# EAGLE design final (EAGLE 9.4.1)
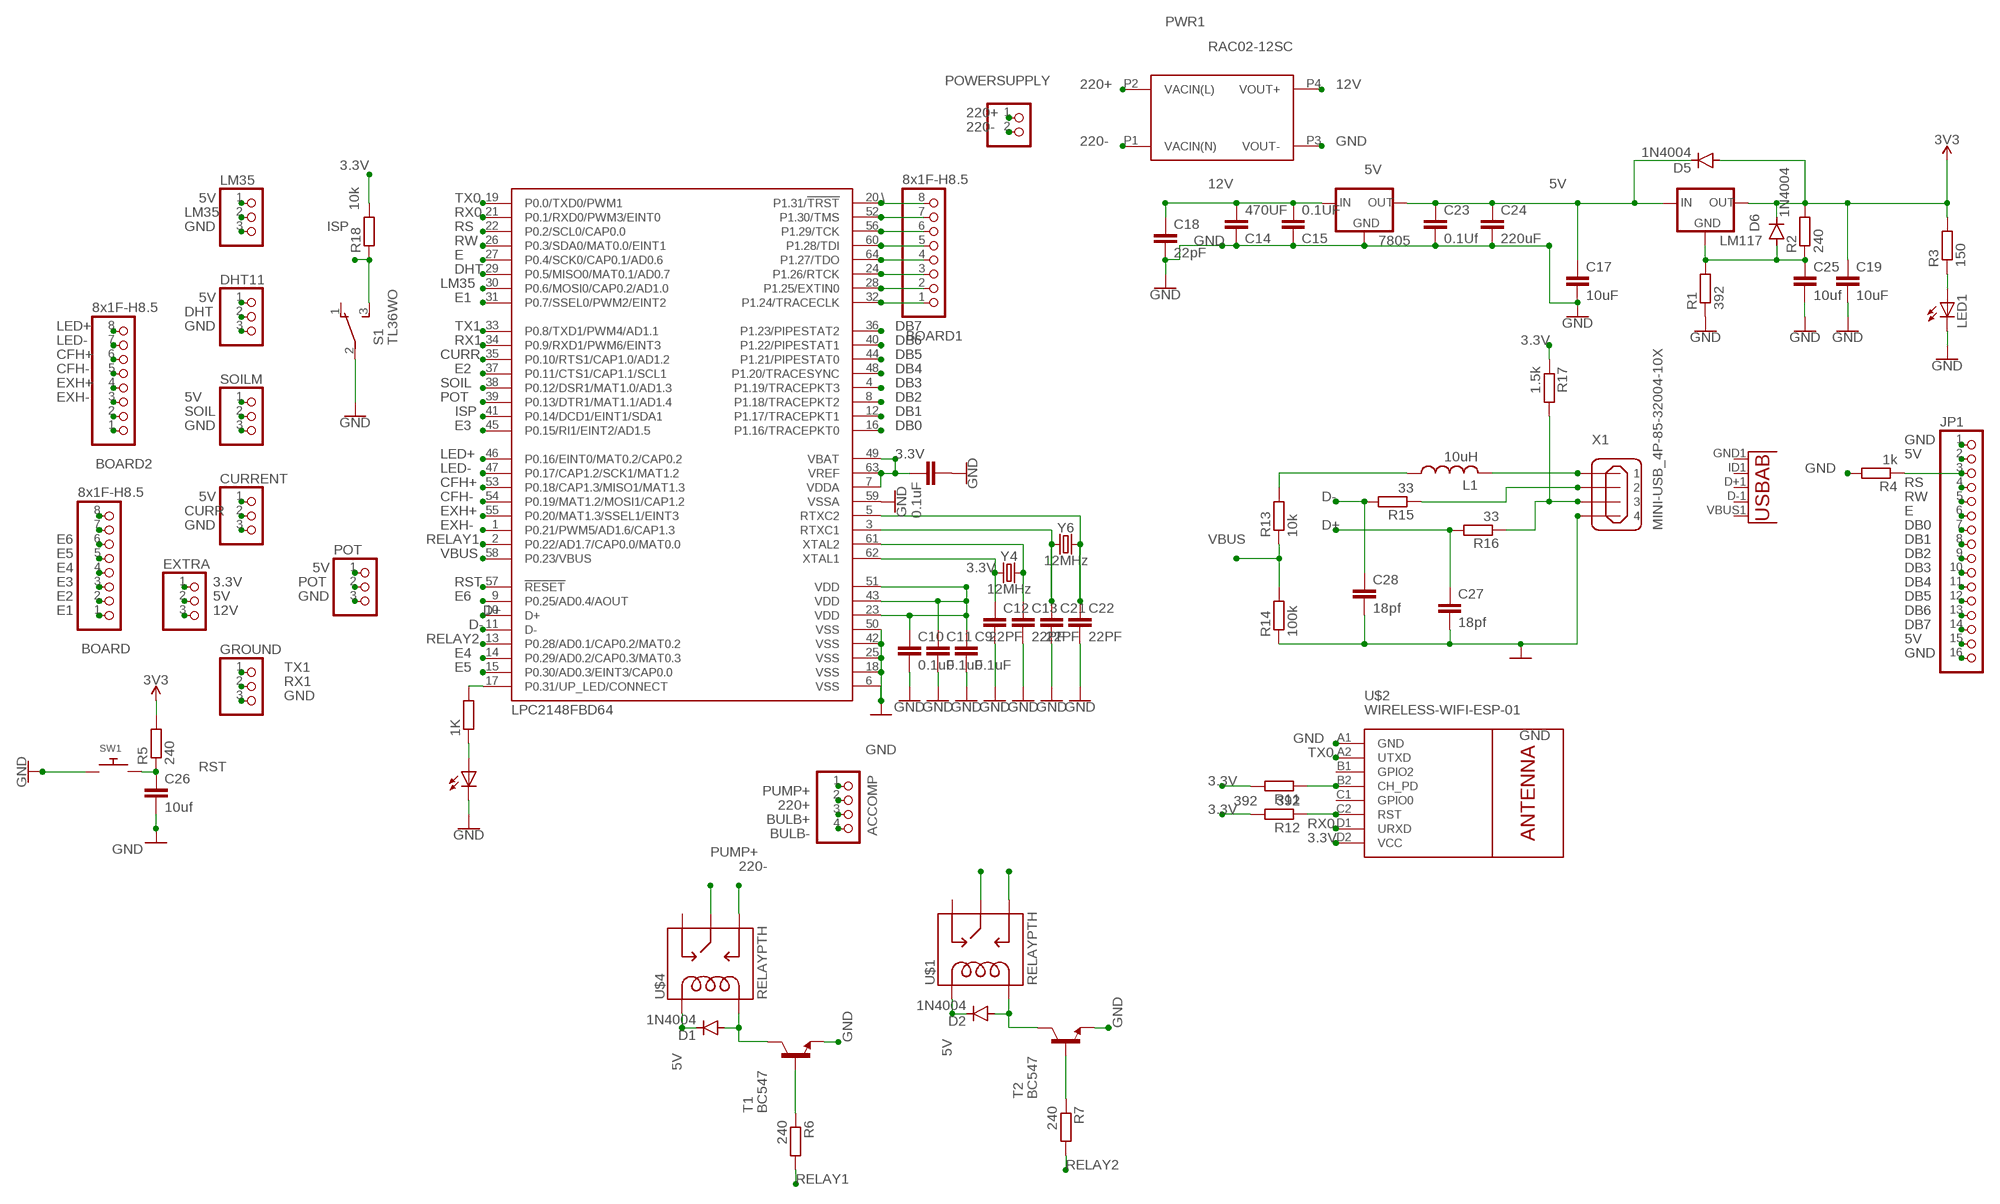
[diagram p0: schematic, sheet 1]

## Parts
1K  1k  R-EU_0204/5  [0204/5]
7805  5V  78XXL  [78XXL]
ACCOMP  PINHD-1X4  [1X04]
BOARD  8x1F-H8.5  PINHD-1X8  [1X08]
BOARD1  8x1F-H8.5  PINHD-1X8  [1X08]
BOARD2  8x1F-H8.5  PINHD-1X8  [1X08]
C9  0.1uF  22PF-0603-50V-5%  [0603]
C10  0.1uF  22PF-0603-50V-5%  [0603]
C11  0.1uF  22PF-0603-50V-5%  [0603]
C12  22PF  22PF-0603-50V-5%  [0603]
C13  22PF  22PF-0603-50V-5%  [0603]
C14  470UF  22PF-0603-50V-5%  [0603]
C15  0.1UF  22PF-0603-50V-5%  [0603]
C16  0.1uF  22PF-0603-50V-5%  [0603]
C17  10uF  22PF-0603-50V-5%  [0603]
C18  22pF  22PF-0603-50V-5%  [0603]
C19  10uF  22PF-0603-50V-5%  [0603]
C21  22PF  22PF-0603-50V-5%  [0603]
C22  22PF  22PF-0603-50V-5%  [0603]
C23  0.1Uf  22PF-0603-50V-5%  [0603]
C24  220uF  22PF-0603-50V-5%  [0603]
C25  10uf  22PF-0603-50V-5%  [0603]
C26  10uf  22PF-0603-50V-5%  [0603]
C27  18pf  22PF-0603-50V-5%  [0603]
C28  18pf  22PF-0603-50V-5%  [0603]
CURRENT  PINHD-1X3  [1X03]
D1  1N4004  [DO41-10]
D2  1N4004  [DO41-10]
D5  1N4004  [DO41-10]
D6  1N4004  [DO41-10]
DHT11  PINHD-1X3  [1X03]
EXTRA  PINHD-1X3  [1X03]
GROUND  PINHD-1X3  [1X03]
JP1  PINHD-1X16  [1X16]
L1  10uH  L-US0204/5  [0204/5]
LED1  LED5MM  [LED5MM]
LED2  LED5MM  [LED5MM]
LM35  PINHD-1X3  [1X03]
LM117  78XXL  [78XXL]
POT  PINHD-1X3  [1X03]
POWERSUPPLY  PINHD-1X2  [1X02]
PWR1  RAC02-12SC  [LOW_PROFILE_POWER_MODULE]
R1  392  R-EU_0204/5  [0204/5]
R2  240  R-EU_0204/5  [0204/5]
R3  150  R-EU_0204/5  [0204/5]
R4  1k  R-EU_0204/5  [0204/5]
R5  240  R-EU_0204/5  [0204/5]
R6  240  R-EU_0204/5  [0204/5]
R7  240  R-EU_0204/5  [0204/5]
R11  392  R-EU_0204/5  [0204/5]
R12  392  R-EU_0204/5  [0204/5]
R13  10k  R-EU_0204/5  [0204/5]
R14  100k  R-EU_0204/5  [0204/5]
R15  33  R-EU_0204/5  [0204/5]
R16  33  R-EU_0204/5  [0204/5]
R17  1.5k  R-EU_0204/5  [0204/5]
R18  10k  R-EU_0204/5  [0204/5]
S1  TL36WO  [TL3XWO]
SOILM  PINHD-1X3  [1X03]
SW1  SWITCH_PUSHBUTTONC&K_KSS  [BTN_CK_KSS]
T1  BC547  [TO92]
T2  BC547  [TO92]
U1  LPC2148FBD64  [TSQFP50P1200X1200X160-64N]
U2  USB""  [USB-MICRO-SMD]
U$1  RELAYPTH  [SRD-05VDC-SL-C]
U$2  WIRELESS-WIFI-ESP-01  [WIRELESS-WIFI-ESP-01]
U$4  RELAYPTH  [SRD-05VDC-SL-C]
X1  MINI-USB_4P-85-32004-10X  [85-32004-10X]
Y4  12MHz  CRYSTAL-16MHZPTH-HC49US  [HC49US]
Y6  12MHz  CRYSTAL-16MHZPTH-HC49US  [HC49US]

## Nets
3.3V: C9.1 C10.1 C11.1 C16.2 EXTRA.1 R11.2 R12.2 R17.1 R18.2 U1.7(VDDA) U1.23(VDD) U1.43(VDD) U1.49(VBAT) U1.51(VDD) U1.63(VREF) U$2.D2(VCC)
5V: 7805.OUT C17.1 C19.1 C23.1 C24.1 CURRENT.1 D1.C D2.C D5.A D5.C D6.C DHT11.1 EXTRA.2 JP1.2 JP1.15 LM35.1 LM117.IN LM117.OUT POT.1 R2.2 R3.2 R5.2 SOILM.1 U$1.COIL1 U$4.COIL1 ; supply symbol labelled 3V3
12V: 7805.IN C14.1 C15.1 C18.1 EXTRA.3 PWR1.P4(VOUT+)
220+: ACCOMP.2 POWERSUPPLY.1 PWR1.P2(VACIN(L))
220-: POWERSUPPLY.2 PWR1.P1(VACIN(N)) U$4.SWOPEN
\: BOARD1.8 U1.20(P1.31/!TRST)
BULB+: ACCOMP.3 U$1.SWCOMMON
BULB-: ACCOMP.4
CFH+: BOARD2.6 U1.53(P0.18/CAP1.3/MISO1/MAT1.3)
CFH-: BOARD2.5 U1.54(P0.19/MAT1.2/MOSI1/CAP1.2)
CURR: CURRENT.2 U1.35(P0.10/RTS1/CAP1.0/AD1.2)
D+: C27.1 R16.2 U1.10(D+)
D-: C28.1 R15.2 U1.11(D-)
DB0: JP1.7 U1.16(P1.16/TRACEPKT0)
DB1: JP1.8 U1.12(P1.17/TRACEPKT1)
DB2: JP1.9 U1.8(P1.18/TRACEPKT2)
DB3: JP1.10 U1.4(P1.19/TRACEPKT3)
DB4: JP1.11 U1.48(P1.20/TRACESYNC)
DB5: JP1.12 U1.44(P1.21/PIPESTAT0)
DB6: JP1.13 U1.40(P1.22/PIPESTAT1)
DB7: JP1.14 U1.36(P1.23/PIPESTAT2)
DHT: DHT11.2 U1.29(P0.5/MISO0/MAT0.1/AD0.7)
E: JP1.6 U1.27(P0.4/SCK0/CAP0.1/AD0.6)
E1: BOARD.1 U1.31(P0.7/SSEL0/PWM2/EINT2)
E2: BOARD.2 U1.37(P0.11/CTS1/CAP1.1/SCL1)
E3: BOARD.3 U1.45(P0.15/RI1/EINT2/AD1.5)
E4: BOARD.4 U1.14(P0.29/AD0.2/CAP0.3/MAT0.3)
E5: BOARD.5 U1.15(P0.30/AD0.3/EINT3/CAP0.0)
E6: BOARD.6 U1.9(P0.25/AD0.4/AOUT)
EXH+: BOARD2.4 U1.55(P0.20/MAT1.3/SSEL1/EINT3)
EXH-: BOARD2.3 U1.1(P0.21/PWM5/AD1.6/CAP1.3)
GND: 7805.GND C9.2 C10.2 C11.2 C12.2 C13.2 C14.2 C15.2 C16.1 C17.2 C18.2 C19.2 C21.2 C22.2 C23.2 C24.2 C25.2 C26.2 C27.2 C28.2 CURRENT.3 DHT11.3 GROUND.3 JP1.1 JP1.16 LED1.K(C) LED2.K(C) LM35.3 POT.3 PWR1.P3(VOUT-) R1.1 R4.2 R14.1 S1.2(P) SOILM.3 SW1.P$1 T1.1(E) T2.1(E) U1.6(VSS) U1.18(VSS) U1.25(VSS) U1.42(VSS) U1.50(VSS) U1.59(VSSA) U$2.A1(GND) X1.4
ISP: R18.1 S1.3(S) U1.41(P0.14/DCD1/EINT1/SDA1)
LED+: BOARD2.8 U1.46(P0.16/EINT0/MAT0.2/CAP0.2)
LED-: BOARD2.7 U1.47(P0.17/CAP1.2/SCK1/MAT1.2)
LM35: LM35.2 U1.30(P0.6/MOSI0/CAP0.2/AD1.0)
N$1: R6.1 T1.2(B)
N$2: R7.1 T2.2(B)
N$3: D1.A T1.3(C) U$4.COIL0
N$4: D2.A T2.3(C) U$1.COIL0
N$6: C12.1 U1.62(XTAL1) Y4.1
N$10: BOARD.8
N$11: BOARD.7
N$12: C13.1 U1.61(XTAL2) Y4.2
N$14: U$1.SWOPEN
N$19: BOARD1.7 U1.52(P1.30/TMS)
N$23: JP1.3 R4.1
N$28: C21.1 U1.3(RTXC1) Y6.1
N$37: C25.1 D6.A LM117.GND R1.2 R2.1
N$52: C22.1 U1.5(RTXC2) Y6.2
N$57: LED1.A R3.1
N$58: 1K.1 LED2.A
N$59: 1K.2 U1.17(P0.31/UP_LED/CONNECT)
N$60: L1.2 X1.1
N$61: R15.1 X1.2
N$64: R16.1 R17.2 X1.3
N$66: BOARD1.1 U1.32(P1.24/TRACECLK)
N$67: BOARD1.2 U1.28(P1.25/EXTIN0)
N$68: BOARD1.3 U1.24(P1.26/RTCK)
N$69: BOARD1.4 U1.64(P1.27/TDO)
N$70: BOARD1.5 U1.60(P1.28/TDI)
N$71: L1.1 R13.2
N$73: BOARD1.6 U1.56(P1.29/TCK)
N$74: R11.1 U$2.B2(CH_PD)
N$75: R12.1 U$2.C2(RST)
POT: POT.2 U1.39(P0.13/DTR1/MAT1.1/AD1.4)
PUMP+: ACCOMP.1 U$4.SWCOMMON
RELAY1: BOARD2.2 R6.2 U1.2(P0.22/AD1.7/CAP0.0/MAT0.0)
RELAY2: BOARD2.1 R7.2 U1.13(P0.28/AD0.1/CAP0.2/MAT0.2)
RS: JP1.4 U1.22(P0.2/SCL0/CAP0.0)
RST: C26.1 R5.1 SW1.P$2 U1.57(!RESET)
RW: JP1.5 U1.26(P0.3/SDA0/MAT0.0/EINT1)
RX0: U1.21(P0.1/RXD0/PWM3/EINT0) U$2.D1(URXD)
RX1: GROUND.2 U1.34(P0.9/RXD1/PWM6/EINT3)
SOIL: SOILM.2 U1.38(P0.12/DSR1/MAT1.0/AD1.3)
TX0: U1.19(P0.0/TXD0/PWM1) U$2.A2(UTXD)
TX1: GROUND.1 U1.33(P0.8/TXD1/PWM4/AD1.1)
VBUS: R13.1 R14.2 U1.58(P0.23/VBUS)
Unconnected: S1.1(O) U2.D+1(D+) U2.D-1(D-) U2.GND1(GND) U2.ID1(USBID) U2.VBUS1(VBUS) U$1.SWCLOSED(SWCLOSE) U$2.B1(GPIO2) U$2.C1(GPIO0) U$4.SWCLOSED(SWCLOSE)

## Library data of the parts
1K R1-R7 R11-R18 = resistor:R-EU_: RESISTOR, European symbol
7805 LM117 = v-reg:78XXL: VOLTAGE REGULATOR
ACCOMP = pinhead:PINHD-1X4: PIN HEADER
BOARD BOARD1 BOARD2 = SmartPrj:PINHD-1X8: PIN HEADER
C9-C17 C19 C21-C28 = SparkFun-Capacitors:22PF: 22pF ceramic capacitors A capacitor is a passive two-terminal electrical component used to store electrical energy temporarily in an electric field.; PROD_ID: CAP-07876; VALUE: 22pF
C18 = SparkFun-Capacitors:22PF: 22pF ceramic capacitors A capacitor is a passive two-terminal electrical component used to store electrical energy temporarily in an electric field.; PROD_ID: CAP-07876
CURRENT DHT11 EXTRA GROUND LM35 POT SOILM = adafruit:PINHD-1X3: PIN HEADER
D1 D2 D5 D6 = diode:1N4004: DIODE general purpose rectifier, 1 A
JP1 = pinhead:PINHD-1X16: PIN HEADER
L1 = resistor:L-US: INDUCTOR, American symbol
LED1 LED2 = adafruit:LED: LED OSRAM: - CHIPLED LG R971, LG N971, LY N971, LG Q971, LY Q971, LO R971, LY R971 LH N974, LH R974 LS Q976, LO Q976, LY Q976 LO Q996 - Hyper CHIPLED LW Q18S LB Q993, LB Q99A, LB R99A - SideLED LS A670, LO A670, LY A670, LG A670, LP A670 LB A673, LV A673, LT A673, LW A673 LH A674 LY A675 LS A676, LA A676, LO A676, LY A676, LW A676 LS A679, LY A679, LG A679 - Hyper Micro SIDELED® LS Y876, LA Y876, LO Y876, LY Y876 LT Y87S - SmartLED LW L88C, LW L88S LB L89C, LB L89S, LG L890 LS L89K, LO L89K, LY L89K LS L896, LA L896, LO L896, LY L896 - TOPLED LS T670, LO T670, LY T670, LG T670, LP T670 LSG T670, LSP T670, LSY T670, LOP T670, LYG T670 LG T671, LOG T671, LSG T671 LB T673, LV T673, LT T673, LW T673 LH T674 LS T676, LA T676, LO T676, LY T676, LB T676, LH T676, LSB T676, LW T676 LB T67C, LV T67C, LT T67C, LS T67K, LO T67K, LY T67K, LW E67C LS E67B, LA E67B, LO E67B, LY E67B, LB E67C, LV E67C, LT E67C LW T67C LS T679, LY T679, LG T679 LS T770, LO T770, LY T770, LG T770, LP T770 LB T773, LV T773, LT T773, LW T773 LH T774 LS E675, LA E675, LY E675, LS T675 LS T776, LA T776, LO T776, LY T776, LB T776 LHGB T686 LT T68C, LB T68C - Hyper Mini TOPLED® LB M676 - Mini TOPLED Santana® LG M470 LS M47K, LO M47K, LY M47K Source: http://www.osram.convergy.de/
POWERSUPPLY = pinhead:PINHD-1X2: PIN HEADER
PWR1 = recom-powerline-acdc-converters:RAC*SC: RECOM POWERLINE AC/DC-Converter (RAC01-SC and RAC02-SC series) The RAC01-SC and RAC02-SC series are ultra-compact universal input AC/DC power modules for PCB mounting. They feature high efficiency, low standby power, high operating temperature, soft start and short-circuit protection as well as a built-in EMC Class B filter. Output voltages range from 3.3VDC to 24VDC. Datasheet <http://www.recom-power.com/pdf/Powerline-AC-DC/RAC01_02-SC.pdf>; INPUT_RANGE: 80 - 277 (VAC); MAX_CAPACITIVE_LOAD: 180uF; OUTPUT_CURRENT: 167mA; OUTPUT_VOLTAGE: 12v
S1 = switch:TL36WO: TINY SWITCH ON - ON Source: http://www2.produktinfo.conrad.com/datenblaetter/700000-724999/705152-da-01-de-Subminiaturschalter_TL_36WO.pdf
SW1 = adafruit:SWITCH_PUSHBUTTON: Buttons SOFTTOUCHSMD_SJ - Soft touch temporary push button (Super Junk Akihabara) Compatible with SKPMANE010 [Mouser: 688-SKPMAN] C&K_KSS = Digikey: KSS221GLFS
T1 T2 = transistor:BC547: NPN TRANSISTOR
U1 = philips-5:LPC2148
U2 = MicroUSB:USB: This is a USB AB connector that is compatible with USB OTG. i.e. this connector can serve as a host or device
U$1 U$4 = SRD-05VDC-SL-C:RELAY: SPDT relay (COM-00101)
U$2 = diy-modules:WIRELESS-WIFI-ESP-01: Wireless Wi-Fi ESP-01 Module based on ESP8266 chip Click here to find device on ebay.com <http://www.ebay.com/sch/esp8266+esp+01+transceiver>
X1 = con-cypressindustries:MINI-USB_4P-: MINI USB 4 Pol. Source: www.cypressindustries.com
Y4 Y6 = SparkFun-Clocks:CRYSTAL-16MHZ: 16MHz Crystal Digikey Example <http://www.digikey.com/product-search/en?keywords=535-9122-1-ND> Frequency: 16MHz Frequency Stability: ±50ppm Frequency Tolerance: ±20ppm Load Capacitance: 18pF SparkFun Products: Pro Micro -5V/16MHz <https://www.sparkfun.com/products/12640> SparkFun Serial Enabled LCD Kit <https://www.sparkfun.com/products/10097>; PROD_ID: XTAL-08181; SF_ID: COM-00536; VALUE: 16MHz

## Net classes
0 default: width 1.016 mm, clearance 0.381 mm

## Board
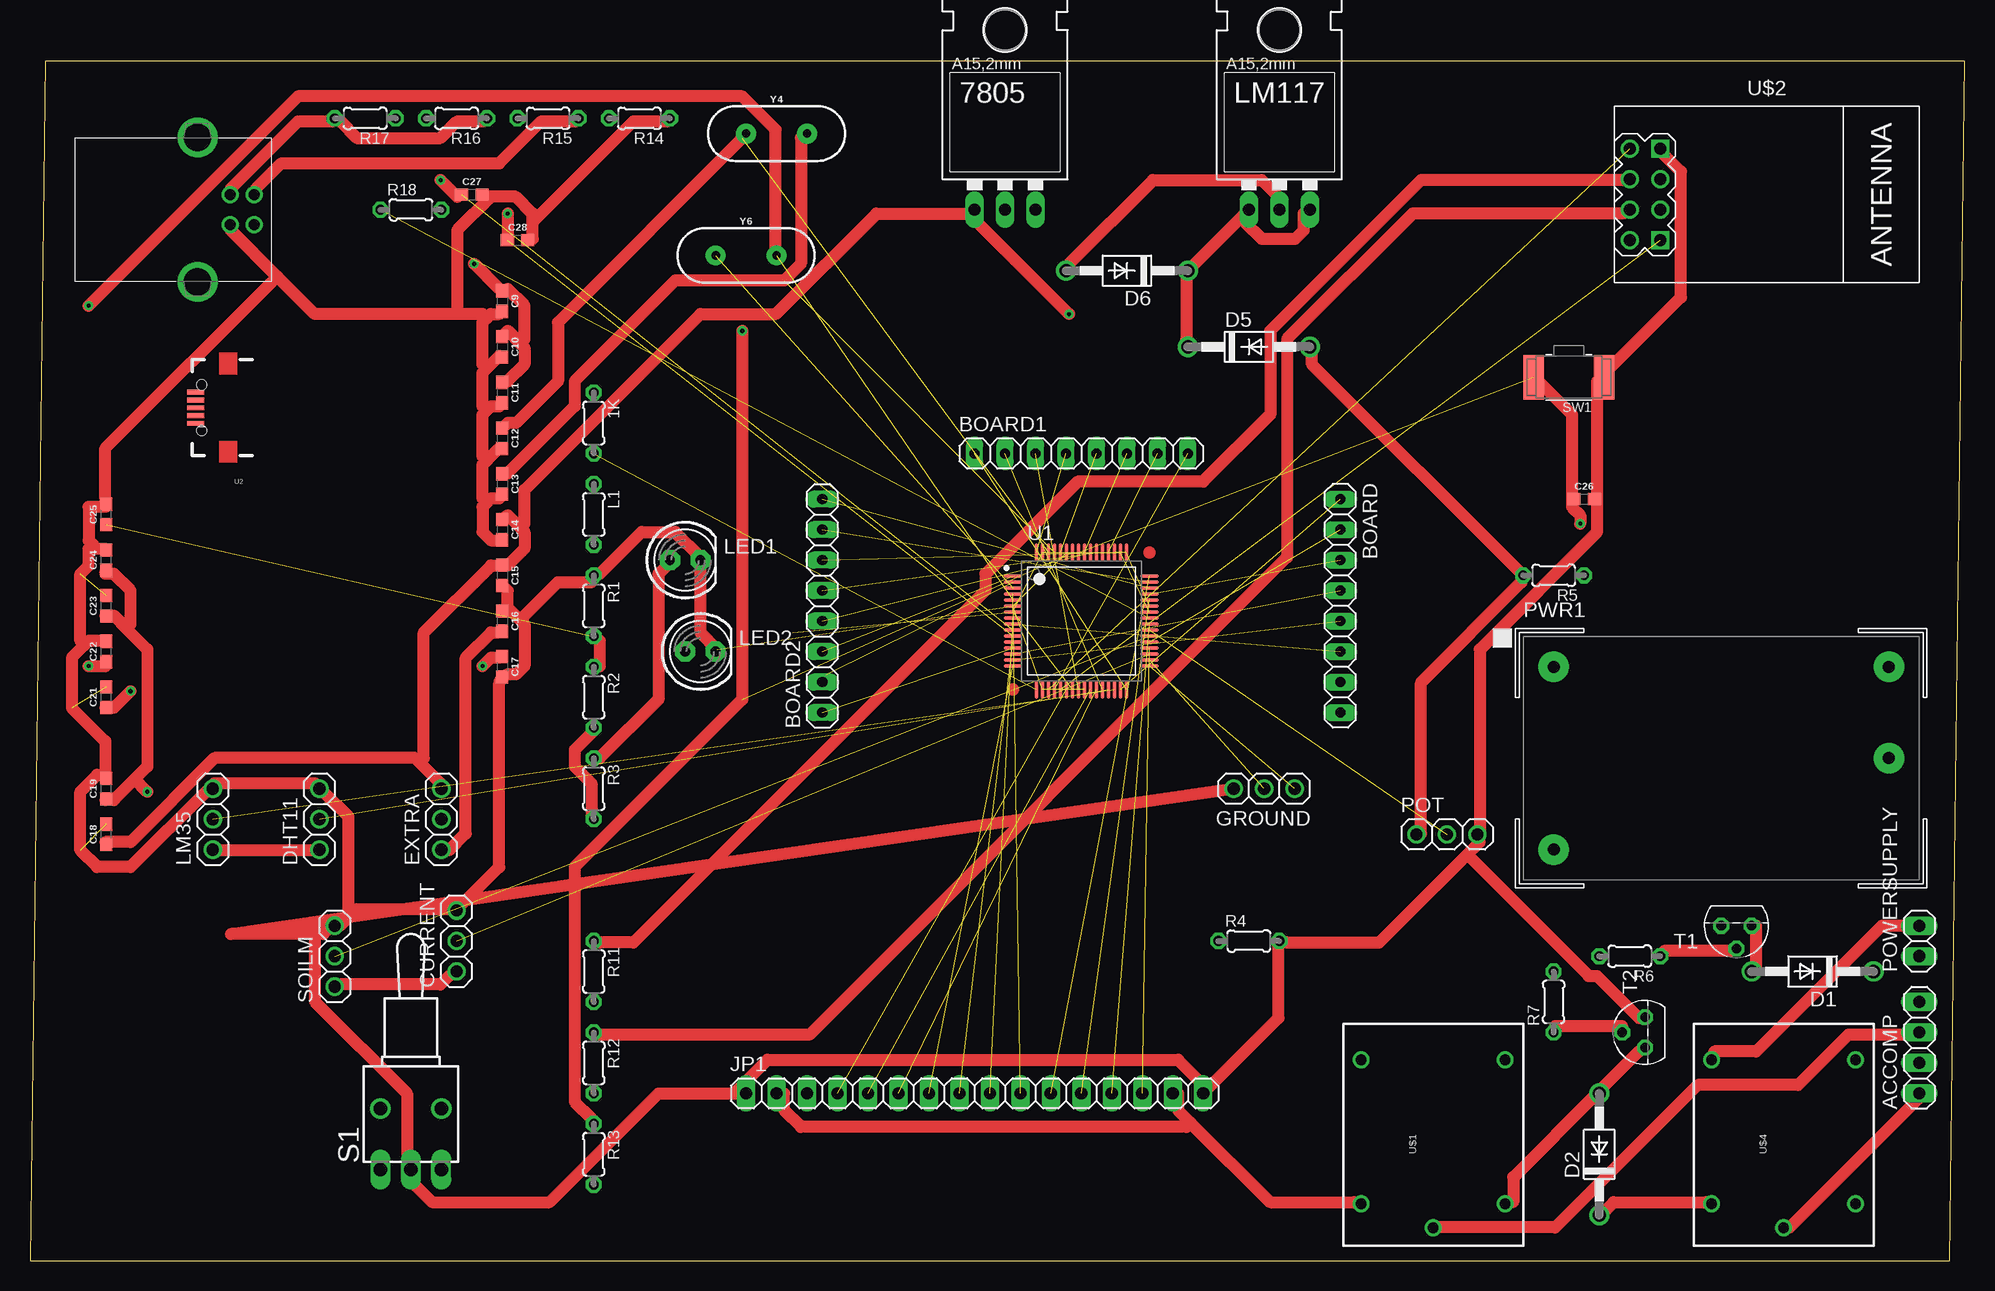
[diagram p1: board, top side]
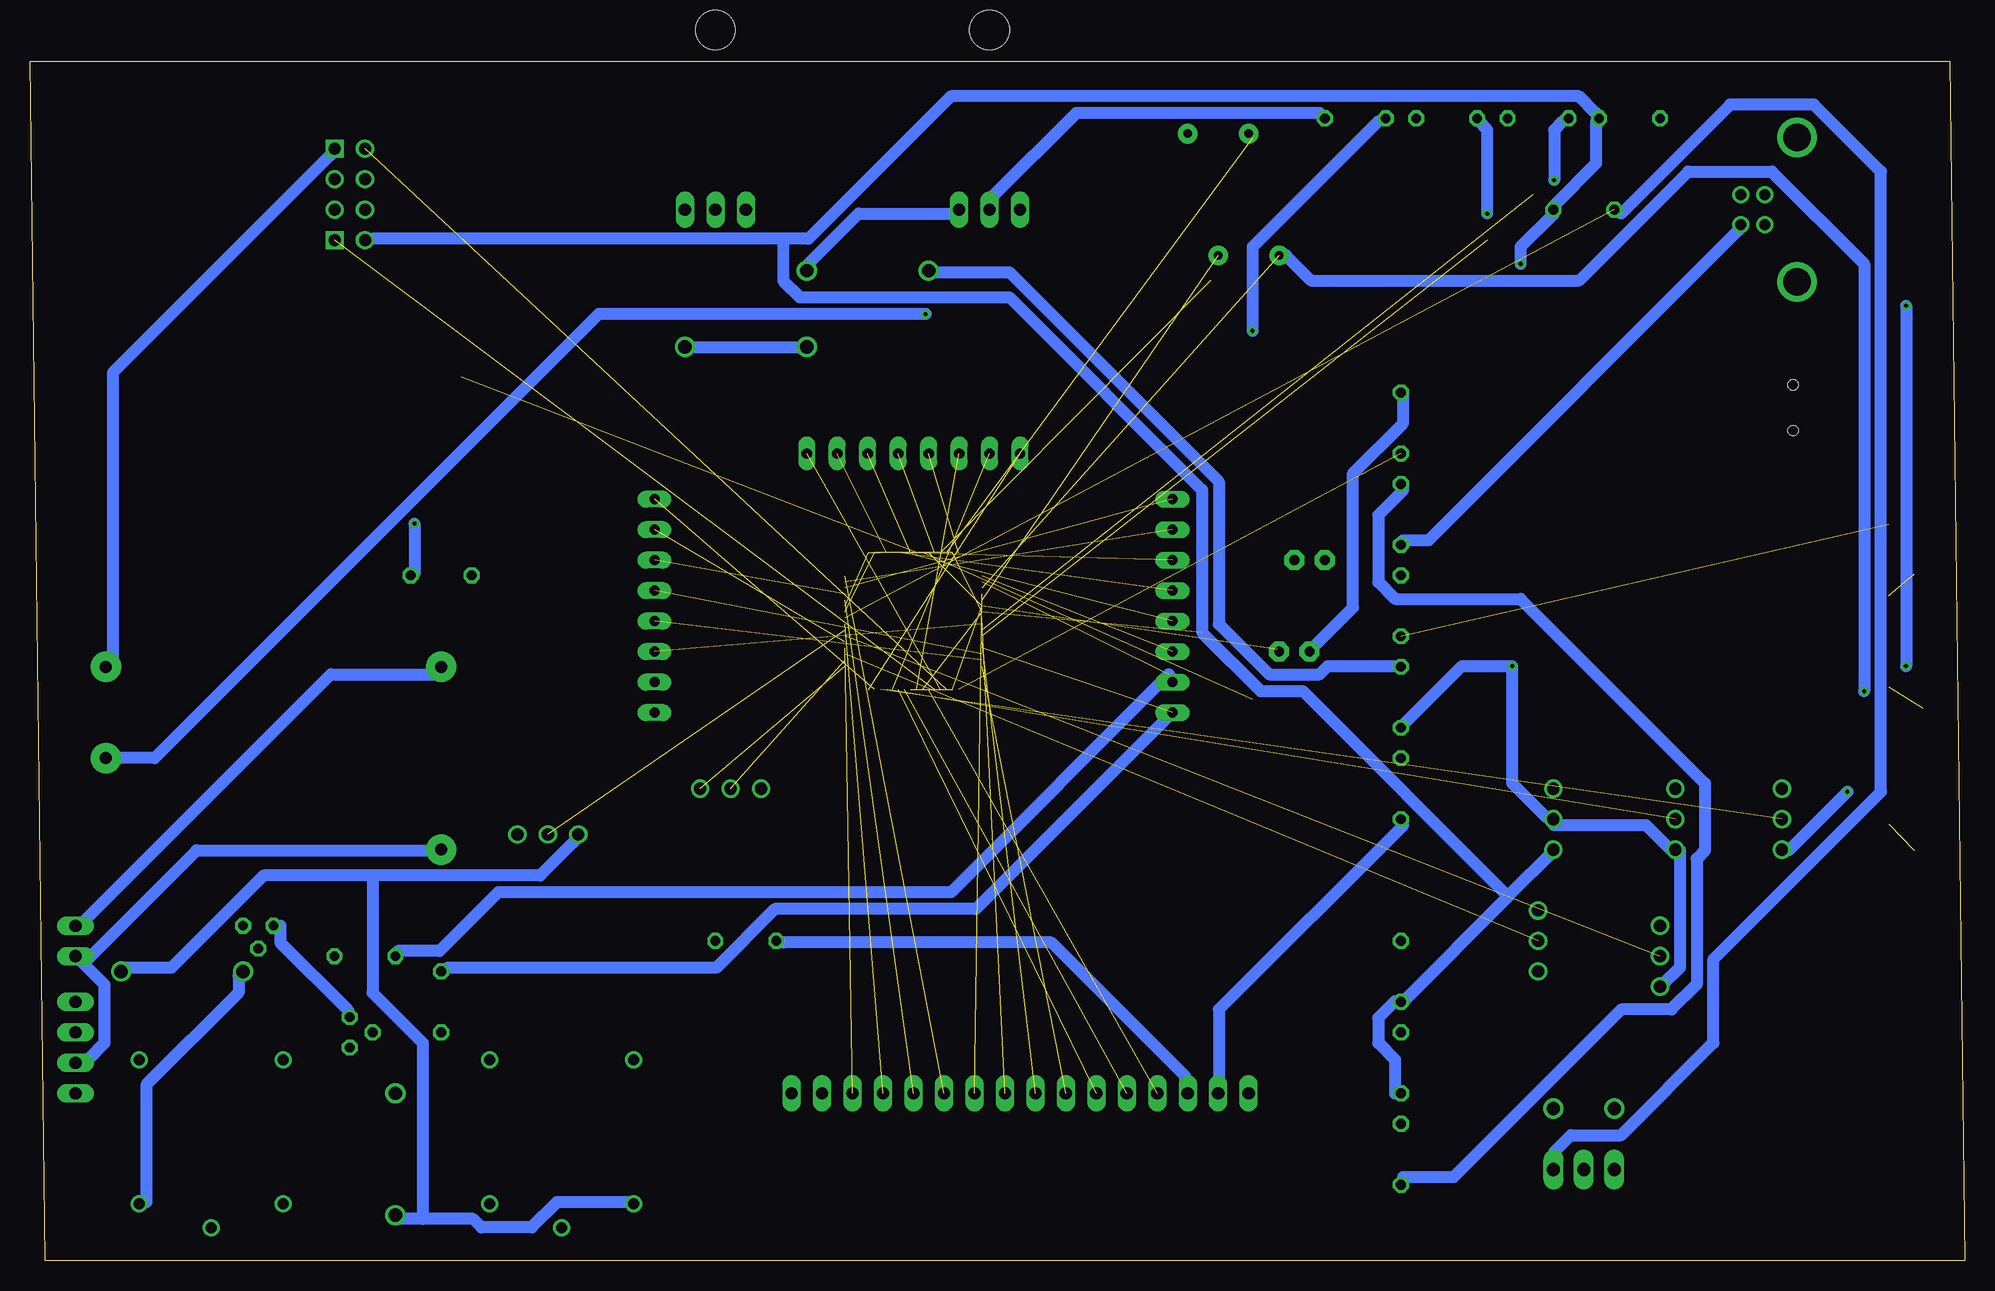
[diagram p2: board, bottom side, seen from below]

Size 161.27 x 100 mm. Coordinates in mm from the lower left corner, seen from the top.
Outline: 0,0 160,0 161.27,100 1.27,100 0,0
Copper layers (1*16): Top 0.035mm / dielectric 1.5mm / Bottom 0.035mm
Design rules "default": minimum track width 6mil, minimum drill 0.35mm, track to track 6mil, track to pad 6mil, pad to pad 6mil, via to via 6mil, smd to smd 6mil, copper to edge 40mil, drill to drill 6mil, minimum pad ring 10mil, minimum via ring 8mil, stop-mask expansion 4mil, vias tented up to drill 0mil, thermal gap 10mil

### Footprints (pad centres in the part's own frame; a part is rotated, then mirrored left to right if it is on the bottom)
0204/5 = drill 0.813 octagon: 1 -2.54,0; 2 2.54,0
78XXL = drill 1.016 long: GND 0,-3.81; IN -2.54,-3.81; OUT 2.54,-3.81 | hole 3.302: 0,11.176
1X04 = drill 1.016 long: 1 -3.81,0; 2 -1.27,0; 3 1.27,0; 4 3.81,0
1X08 = drill 0.85 pad 1.422 long: 1 -8.89,0; 2 -6.35,0; 3 -3.81,0; 4 -1.27,0; 5 1.27,0; 6 3.81,0; 7 6.35,0; 8 8.89,0
0603 = smd 1.1 x 1: 1 -0.85,0; 2 0.85,0
1X03 = drill 1.016: 1 -2.54,0; 2 0,0; 3 2.54,0
DO41-10 = drill 1.118: A 5.08,0; C -5.08,0
1X16 = drill 1.016 long: 1 -19.05,0; 2 -16.51,0; 3 -13.97,0; 4 -11.43,0; 5 -8.89,0; 6 -6.35,0; 7 -3.81,0; 8 -1.27,0; 9 1.27,0; 10 3.81,0; 11 6.35,0; 12 8.89,0; 13 11.43,0; 14 13.97,0; 15 16.51,0; 16 19.05,0
LED5MM = drill 0.813 pad 1.676 octagon: A -1.27,0; K 1.27,0
1X02 = drill 1.016 long: 1 -1.27,0; 2 1.27,0
LOW_PROFILE_POWER_MODULE = drill 1 pad 2.54: P1 -12.7,7.62; P2 -12.7,-7.62; P3 15.24,7.62; P4 15.24,0
TL3XWO = drill 1.1 pad 1.422 long: 1 -2.54,-5.08; 2 0,-5.08; 3 2.54,-5.08 | drill 1.1 pad 1.676: M1 -2.54,0; M2 2.54,0
BTN_CK_KSS = smd 1.7 x 3.7: P$1 -2.95,0; P$2 2.95,0
TO92 = drill 0.813 octagon: 1 1.27,0; 2 0,1.905; 3 -1.27,0
TSQFP50P1200X1200X160-64N = smd 1.55 x 0.3: 1 -5.7,3.75; 2 -5.7,3.25; 3 -5.7,2.75; 4 -5.7,2.25; 5 -5.7,1.75; 6 -5.7,1.25; 7 -5.7,0.75; 8 -5.7,0.25; 9 -5.7,-0.25; 10 -5.7,-0.75; 11 -5.7,-1.25; 12 -5.7,-1.75; 13 -5.7,-2.25; 14 -5.7,-2.75; 15 -5.7,-3.25; 16 -5.7,-3.75; 33 5.7,-3.75; 34 5.7,-3.25; 35 5.7,-2.75; 36 5.7,-2.25; 37 5.7,-1.75; 38 5.7,-1.25; 39 5.7,-0.75; 40 5.7,-0.25; 41 5.7,0.25; 42 5.7,0.75; 43 5.7,1.25; 44 5.7,1.75; 45 5.7,2.25; 46 5.7,2.75; 47 5.7,3.25; 48 5.7,3.75 | smd 0.3 x 1.55: 17 -3.75,-5.7; 18 -3.25,-5.7; 19 -2.75,-5.7; 20 -2.25,-5.7; 21 -1.75,-5.7; 22 -1.25,-5.7; 23 -0.75,-5.7; 24 -0.25,-5.7; 25 0.25,-5.7; 26 0.75,-5.7; 27 1.25,-5.7; 28 1.75,-5.7; 29 2.25,-5.7; 30 2.75,-5.7; 31 3.25,-5.7; 32 3.75,-5.7; 49 3.75,5.7; 50 3.25,5.7; 51 2.75,5.7; 52 2.25,5.7; 53 1.75,5.7; 54 1.25,5.7; 55 0.75,5.7; 56 0.25,5.7; 57 -0.25,5.7; 58 -0.75,5.7; 59 -1.25,5.7; 60 -1.75,5.7; 61 -2.25,5.7; 62 -2.75,5.7; 63 -3.25,5.7; 64 -3.75,5.7
USB-MICRO-SMD = smd 1.4 x 0.4: D+1 2.7,0; D-1 2.7,0.65; GND1 2.7,-1.3; ID1 2.7,-0.65; VBUS1 2.7,1.3 | hole 0.85: 2.2,1.9; 2.2,-1.9
SRD-05VDC-SL-C = drill 0.9: COIL0 -5.39,-6.12; COIL1 -5.39,5.88; SWCLOSED 6.61,-6.12; SWCOMMON -7.39,-0.12; SWOPEN 6.61,5.88
WIRELESS-WIFI-ESP-01 = drill 1 square: A1 -8.89,3.81; D1 -8.89,-3.81 | drill 1: A2 -11.43,3.81; B1 -8.89,1.27; B2 -11.43,1.27; C1 -8.89,-1.27; C2 -11.43,-1.27; D2 -11.43,-3.81
85-32004-10X = drill 0.92 pad 1.27: 1 4.71,-1.25; 2 4.71,1.25; 3 2.71,1.25; 4 2.71,-1.25 | drill 2.3 pad 3: M1 0,6.02; M2 0,-6.02
HC49US = drill 0.7 pad 1.651: 1 -2.54,0; 2 2.54,0

### Placement (x,y rotation side)
1K  46.99,69.85 270 top
7805  81.28,91.44 0 top
ACCOMP  157.48,17.78 90 top
BOARD  109.22,54.61 270 top
BOARD1  87.63,67.31 0 top
BOARD2  66.04,54.61 90 top
C9  39.37,80.01 270 top
C10  39.37,76.2 270 top
C11  39.37,72.39 270 top
C12  39.37,68.58 270 top
C13  39.37,64.77 270 top
C14  39.37,60.96 270 top
C15  39.37,57.15 270 top
C16  39.37,53.34 270 top
C17  39.37,49.53 270 top
C18  6.35,35.56 90 top
C19  6.35,39.37 90 top
C21  6.35,46.99 90 top
C22  6.35,50.8 90 top
C23  6.35,54.61 90 top
C24  6.35,58.42 90 top
C25  6.35,62.23 90 top
C26  129.54,63.5 0 top
C27  36.83,88.9 0 top
C28  40.64,85.09 0 top
CURRENT  35.56,26.67 90 top
D1  148.59,24.13 180 top
D2  130.81,8.89 90 top
D5  101.6,76.2 0 top
D6  91.44,82.55 180 top
DHT11  24.13,36.83 90 top
EXTRA  34.29,36.83 90 top
GROUND  102.87,39.37 180 top
JP1  78.74,13.97 0 top
L1  46.99,62.23 270 top
LED1  54.61,58.42 0 top
LED2  55.88,50.8 0 top
LM35  15.24,36.83 90 top
LM117  104.14,91.44 0 top
POT  118.11,35.56 0 top
POWERSUPPLY  157.48,26.67 90 top
PWR1  139.7,41.91 0 top
R1  46.99,54.61 270 top
R2  46.99,46.99 270 top
R3  46.99,39.37 270 top
R4  101.6,26.67 0 top
R5  127,57.15 180 top
R6  133.35,25.4 180 top
R7  127,21.59 90 top
R11  46.99,24.13 270 top
R12  46.99,16.51 270 top
R13  46.99,8.89 270 top
R14  50.8,95.25 180 top
R15  43.18,95.25 180 top
R16  35.56,95.25 180 top
R17  27.94,95.25 180 top
R18  31.75,87.63 0 top
S1  31.75,12.7 0 top
SOILM  25.4,25.4 90 top
SW1  128.27,73.66 180 top
T1  142.24,27.94 180 top
T2  134.62,19.05 90 top
U1  87.63,53.34 0 top
U2  16.51,71.12 180 top
U$1  116.84,10.16 90 top
U$2  144.78,88.9 0 top
U$4  146.05,10.16 90 top
X1  13.97,87.63 0 top
Y4  62.23,93.98 0 top
Y6  59.69,83.82 0 top

### Tracks (layer width: path | path; a pad name or v marks a point on that pad's centre or on a via)
3.3V  (via drill 0.35)  (6 unrouted)
  Top 1.016: C16.2 39.12,52.39 38.42,52.39 36.32,50.29 36.32,35.62 34.92,34.23 EXTRA.1 | 40.86,76.49 39.81,77.53 C10.1 | 40.86,76.49 41.21,76.14 41.21,74.74 39.81,73.34 C11.1 | 40.86,76.49 41.21,76.83 41.21,79.63 39.81,81.03 C9.1 39.12,81.03 v37.02,83.12
  Bottom 1.016: R12.2 47.5,13.97 47.5,16.76 48.9,18.16 48.9,20.26 47.5,21.65 R11.2 46.8,21.65 38.07,30.39 | 38.07,30.39 34.23,34.23 EXTRA.1 | 98.49,85.22 96.39,85.22 84.52,97.09 32.13,97.09 30.73,95.69 R17.1 30.73,95 30.73,91.5 34.23,88.01 R18.2 34.23,87.31 37.02,84.52 v37.02,83.12 | 98.49,85.22 132.72,85.22 U$2.D2 | 38.07,30.39 55.18,47.5 58.67,47.5 63.56,52.39 63.56,64.26 79.63,80.33 97.09,80.33 98.49,81.72 98.49,85.22
5V  (via drill 0.35)
  Top 1.016: v37.72,49.59 38.42,50.29 39.12,50.29 C17.1 | R3.2 46.8,37.02 46.8,39.81 45.4,41.21 45.4,42.61 46.8,44.01 R2.2 | 8.73,40.16 9.78,41.21 9.78,50.99 8.03,52.74 | 8.73,40.16 6.99,38.42 6.29,38.42 C19.1 | 8.03,52.74 6.99,53.78 6.29,53.78 C23.1 | C24.1 6.29,57.28 6.99,57.28 8.38,55.88 8.38,53.09 8.03,52.74 | SOILM.1 25.84,23.05 34.23,23.05 34.92,23.75 CURRENT.1 | LM35.1 15.37,34.23 23.75,34.23 DHT11.1 | v9.78,39.12 8.73,40.16 | U$4.COIL1 139.7,4.89 132.02,4.89 131.32,4.19 D2.C | 96.74,11.53 95.69,12.57 95.69,13.97 JP1.15 | 96.74,11.53 103.38,4.89 110.36,4.89 U$1.COIL1 | LM117.OUT 106.17,87.31 106.17,85.92 105.47,85.22 102.68,85.22 101.28,86.61 LM117.IN D6.C 96.39,82.42 96.39,76.83 D5.C | POT.1 115.95,35.62 115.95,48.2 124.33,56.58 R5.2 106.87,74.74 106.87,76.14 D5.A | JP1.2 62.87,13.97 62.87,12.57 64.26,11.18 96.39,11.18 96.74,11.53
  Bottom 1.016: R2.2 46.8,44.7 41.91,49.59 v37.72,49.59 37.72,39.81 34.92,37.02 EXTRA.2 34.23,36.32 26.54,36.32 24.45,34.23 DHT11.1 23.75,34.23 23.75,24.45 25.15,23.05 SOILM.1 | JP1.2 62.17,13.97 62.17,20.95 46.8,36.32 R3.2 | v9.78,39.12 14.67,34.23 LM35.1 | 128.52,3.49 124.33,3.49 123.64,2.79 119.44,2.79 117.35,4.89 111.06,4.89 U$1.COIL1 | 128.52,3.49 130.62,3.49 D2.C | 7805.OUT 83.82,87.31 92.2,87.31 96.39,83.12 D6.C | D5.A 106.17,76.14 97.09,76.14 D5.C | 132.72,32.13 118.75,32.13 115.95,34.92 POT.1 | 132.72,32.13 141.8,32.13 149.48,24.45 153.67,24.45 D1.C | 128.52,3.49 128.52,18.16 132.72,22.35 132.72,32.13
12V  (via drill 0.35)
  Top 1.016: 40.86,61.12 39.81,62.17 C14.1 | 40.86,61.12 41.21,60.77 41.21,59.37 39.81,57.98 C15.1 39.12,57.98 38.42,57.98 32.83,52.39 32.83,41.91 32.48,41.56 | 32.48,41.56 34.23,39.81 EXTRA.3 | 32.48,41.56 32.13,41.91 15.37,41.91 8.38,34.92 6.29,34.92 C18.1 | 78.23,87.31 70.55,87.31 62.17,78.93 55.88,78.93 41.21,64.26 41.21,61.47 40.86,61.12 | 78.23,87.31 v86.61,78.93 | 78.23,87.31 7805.IN
  Bottom 1.016: PWR1.P4 150.88,41.91 113.86,78.93 v86.61,78.93
220+
  Bottom 1.016: ACCOMP.2 157.16,16.76 156.46,16.76 155.07,18.16 155.07,23.05 157.16,25.15 POWERSUPPLY.1 156.46,25.15 147.38,34.23 127.13,34.23 PWR1.P2
220-
  Top 1.016: POWERSUPPLY.2 154.37,27.94 143.89,17.46 140.4,17.46 U$4.SWOPEN
  Bottom 1.016: PWR1.P1 127.13,48.9 136.21,48.9 157.16,27.94 POWERSUPPLY.2
\  (1 unrouted)
BULB+
  Top 1.016: U$1.SWCOMMON 117.35,2.79 127.13,2.79 139,14.67 147.38,14.67 151.57,18.86 157.16,18.86 ACCOMP.3
CFH+  (1 unrouted)
CFH-  (1 unrouted)
CURR  (1 unrouted)
D+  (via drill 0.35)  (1 unrouted)
  Top 1.016: v34.23,90.11 35.62,88.71 C27.1
  Bottom 1.016: v34.23,90.11 34.23,94.3 33.53,95 R16.2
D-  (via drill 0.35)  (1 unrouted)
  Top 1.016: v39.81,87.31 39.81,85.22 C28.1
  Bottom 1.016: v39.81,87.31 39.81,94.3 40.51,95 R15.2
DB0  (1 unrouted)
DB1  (1 unrouted)
DB2  (1 unrouted)
DB3  (1 unrouted)
DB4  (1 unrouted)
DB5  (1 unrouted)
DB6  (1 unrouted)
DB7  (1 unrouted)
DHT  (1 unrouted)
E  (1 unrouted)
E1  (1 unrouted)
E2  (1 unrouted)
E3  (1 unrouted)
E4  (1 unrouted)
E5  (1 unrouted)
E6  (1 unrouted)
EXH+  (1 unrouted)
EXH-  (1 unrouted)
GND  (9 unrouted)
  Top 1.016: 119.79,33.88 112.46,26.54 104.78,26.54 R4.2 104.08,26.54 104.08,20.26 JP1.16 97.79,14.67 95.69,16.76 61.47,16.76 58.67,13.97 | 119.79,33.88 120.84,34.92 POT.3 120.84,35.62 120.84,50.99 130.62,60.77 130.62,63.56 | 119.79,33.88 129.92,23.75 130.62,23.75 134.11,20.26 T2.1 | 130.62,63.56 130.62,73.34 SW1.P$1 131.32,74.04 137.6,80.33 137.6,90.81 136.21,92.2 U$2.A1 | 130.62,63.56 C26.2 | 38.07,63.21 38.42,63.56 39.12,63.56 C13.2 | 38.07,63.21 37.72,62.87 37.72,60.77 38.42,60.07 39.12,60.07 C14.2 | 38.07,66.71 37.72,66.36 37.72,63.56 38.07,63.21 | 38.07,66.71 39.12,67.75 C12.2 | 38.07,70.9 37.72,70.55 37.72,67.06 38.07,66.71 | 38.07,70.9 38.42,71.25 39.12,71.25 C11.2 | 38.07,74.39 37.72,74.04 37.72,71.25 38.07,70.9 | 38.07,74.39 39.12,75.44 C10.2 | 38.07,78.58 37.72,78.23 37.72,74.74 38.07,74.39 | 38.07,78.58 38.42,78.93 39.12,78.93 C9.2 | 20.61,82.07 23.75,78.93 35.62,78.93 | 20.61,82.07 16.76,85.92 X1.4 | 35.62,78.93 37.72,78.93 38.07,78.58 | 38.42,88.71 40.51,88.71 41.91,87.31 41.91,86.61 | 38.42,88.71 37.72,88.71 C27.2 | 41.91,86.61 41.91,85.22 C28.2 | 41.91,86.61 50.29,95 53.09,95 R14.1 | 35.62,78.93 35.62,85.92 38.42,88.71 | 58.67,13.97 52.39,13.97 43.31,4.89 33.53,4.89 31.43,6.99 S1.2 31.43,7.68 31.43,13.97 23.75,21.65 23.75,27.24 | 58.67,13.97 JP1.1 | LED2.K 57.28,50.99 55.88,52.39 LED1.K 55.88,58.67 53.78,60.77 50.99,60.77 47.5,57.28 R1.1 46.8,56.58 44.01,56.58 40.86,53.44 | 39.81,54.48 40.86,53.44 | 40.86,53.44 41.21,53.09 41.21,49.59 40.51,48.9 39.81,48.9 C17.2 39.12,48.2 39.12,32.83 35.62,29.34 CURRENT.3 34.92,29.34 27.24,29.34 26.89,28.99 | 39.81,54.48 39.81,55.88 C15.2
  Top 1.016: 39.81,54.48 C16.1 | 5.24,59.72 4.89,60.07 4.89,62.87 6.29,62.87 C25.2 6.29,63.56 6.29,67.75 20.61,82.07 | 5.24,59.72 5.59,59.37 6.29,59.37 C24.2 | 6.29,40.51 6.29,43.31 3.49,46.1 3.49,50.29 4.54,51.34 | 4.54,51.34 4.89,51.69 6.29,51.69 C22.2 | 5.24,59.72 4.89,59.37 4.89,57.98 4.19,57.28 4.19,51.69 4.54,51.34 | 23.75,27.24 24.45,27.24 25.15,27.94 SOILM.3 25.84,27.94 26.89,28.99 | 23.75,27.24 16.76,27.24 GROUND.3 | 26.89,28.99 26.54,29.34 26.54,37.02 24.45,39.12 DHT11.3 23.75,39.81 15.37,39.81 LM35.3 14.67,39.12 8.38,32.83 5.59,32.83 4.19,34.23 4.19,39.12 5.59,40.51 6.29,40.51 | 6.29,40.51 C19.2
  Bottom 1.016: T2.1 134.81,20.95 140.4,26.54 140.4,27.94 T1.1 | PWR1.P3 154.37,49.59 154.37,74.04 136.21,92.2 U$2.A1 | 7805.GND 81.03,88.01 81.03,88.71 74.04,95.69 53.78,95.69 R14.1
ISP  (1 unrouted)
  Bottom 1.016: R18.1 28.64,87.31 19.56,96.39 12.57,96.39 6.99,90.81 6.99,39.12 20.95,25.15 20.95,18.16 28.64,10.48 32.83,10.48 34.23,9.08 34.23,7.68 S1.3
LED+  (1 unrouted)
LED-  (1 unrouted)
LM35  (1 unrouted)
N$1
  Top 1.016: R6.1 136.21,25.84 141.8,25.84 T1.2
N$2
  Top 1.016: R7.1 127.13,19.56 132.72,19.56 T2.2
N$3
  Top 1.016: T1.3 143.89,27.94 143.89,24.45 D1.A
  Bottom 1.016: U$4.COIL0 151.57,4.89 151.57,14.67 143.89,22.35 143.89,23.75 D1.A
N$4
  Top 1.016: 130.62,13.97 134.11,17.46 T2.3 | 130.62,13.97 123.64,6.99 123.64,4.89 U$1.COIL0 | 130.62,13.97 D2.A
N$6  (1 unrouted)
  Top 1.016: C12.1 39.81,69.85 40.51,69.85 44.01,73.34 44.01,78.23 59.37,93.6 Y4.1
N$12  (1 unrouted)
  Top 1.016: C13.1 39.81,65.66 45.4,71.25 45.4,73.34 53.78,81.72 62.87,81.72 64.26,83.12 64.26,93.6 Y4.2
N$19  (1 unrouted)
N$23
  Bottom 1.016: R4.1 98.49,26.54 76.14,26.54 64.96,15.37 64.96,13.97 JP1.3
N$28  (via drill 0.35)  (1 unrouted)
  Top 1.016: v8.38,47.5 6.99,46.1 6.29,46.1 C21.1
  Bottom 1.016: v8.38,47.5 8.38,83.12 16.07,90.81 23.05,90.81 32.13,81.72 54.48,81.72 56.58,83.82 Y6.1
N$37  (1 unrouted)
  Top 1.016: R2.1 47.5,49.59 47.5,51.69 R1.2 | LM117.GND 104.08,88.01 104.08,88.71 102.68,90.11 93.6,90.11 86.61,83.12 D6.A
  Bottom 1.016: R2.1 47.5,49.59 53.09,49.59 53.78,48.9 57.98,48.9 62.17,53.09 62.17,64.96 79.63,82.42 85.92,82.42 D6.A
N$52  (via drill 0.35)  (1 unrouted)
  Top 1.016: v4.89,49.59 6.29,49.59 C22.1 | v4.89,79.63 22.35,97.09 59.37,97.09 62.17,94.3 62.17,83.82 Y6.2
  Bottom 1.016: v4.89,79.63 v4.89,49.59
N$57
  Top 1.016: R3.1 47.5,41.91 52.39,46.8 52.39,57.28 53.09,57.98 LED1.A
N$58
  Bottom 1.016: 1K.1 46.8,71.94 46.8,69.85 50.99,65.66 50.99,54.48 54.48,50.99 LED2.A
N$59  (1 unrouted)
N$60
  Bottom 1.016: L1.2 46.8,60.07 44.7,60.07 18.86,85.92 X1.1
N$61
  Top 1.016: R15.1 45.4,95 42.61,95 39.12,91.5 20.95,91.5 18.86,89.41 X1.2
N$64
  Top 1.016: X1.3 16.76,89.41 22.35,95 25.15,95 R17.2 25.84,95 27.24,93.6 34.23,93.6 35.62,95 37.72,95 R16.1
N$66  (1 unrouted)
N$67  (1 unrouted)
N$68  (1 unrouted)
N$69  (1 unrouted)
N$70  (1 unrouted)
N$71
  Bottom 1.016: R13.2 46.8,6.99 42.61,6.99 28.64,20.95 24.45,20.95 22.35,23.05 22.35,33.53 21.65,34.23 21.65,39.81 37.02,55.18 47.5,55.18 48.9,56.58 48.9,62.17 46.8,64.26 L1.1
N$73  (1 unrouted)
N$74
  Top 1.016: R11.1 47.5,26.54 50.29,26.54 79.63,55.88 79.63,57.28 87.31,64.96 97.79,64.96 103.38,70.55 103.38,77.53 115.95,90.11 132.72,90.11 U$2.B2
N$75
  Top 1.016: R12.1 47.5,18.86 64.96,18.86 104.78,58.67 104.78,76.83 115.25,87.31 132.72,87.31 U$2.C2
POT  (1 unrouted)
PUMP+
  Top 1.016: U$4.SWCOMMON 146.69,2.79 157.86,13.97 ACCOMP.1
RELAY1  (1 unrouted)
  Bottom 1.016: R6.2 130.62,25.84 127.13,25.84 122.24,30.73 84.52,30.73 66.36,48.9 BOARD2.2
RELAY2  (1 unrouted)
  Bottom 1.016: BOARD2.1 82.42,29.34 99.19,29.34 104.08,24.45 126.43,24.45 R7.2
RS  (1 unrouted)
RST  (via drill 0.35)  (1 unrouted)
  Top 1.016: 128.52,63.56 128.52,70.55 125.73,73.34 SW1.P$2 | v129.22,61.47 129.22,62.17 128.52,62.87 128.52,63.56 | 128.52,63.56 C26.1
  Bottom 1.016: v129.22,61.47 129.22,57.28 R5.1
RW  (1 unrouted)
RX0  (1 unrouted)
RX1  (1 unrouted)
SOIL  (1 unrouted)
TX0  (1 unrouted)
TX1  (1 unrouted)
VBUS  (via drill 0.35)  (1 unrouted)
  Top 1.016: v59.37,77.53 59.37,46.8 45.4,32.83 45.4,13.27 46.8,11.87 R13.1
  Bottom 1.016: v59.37,77.53 59.37,84.52 48.9,95 R14.2